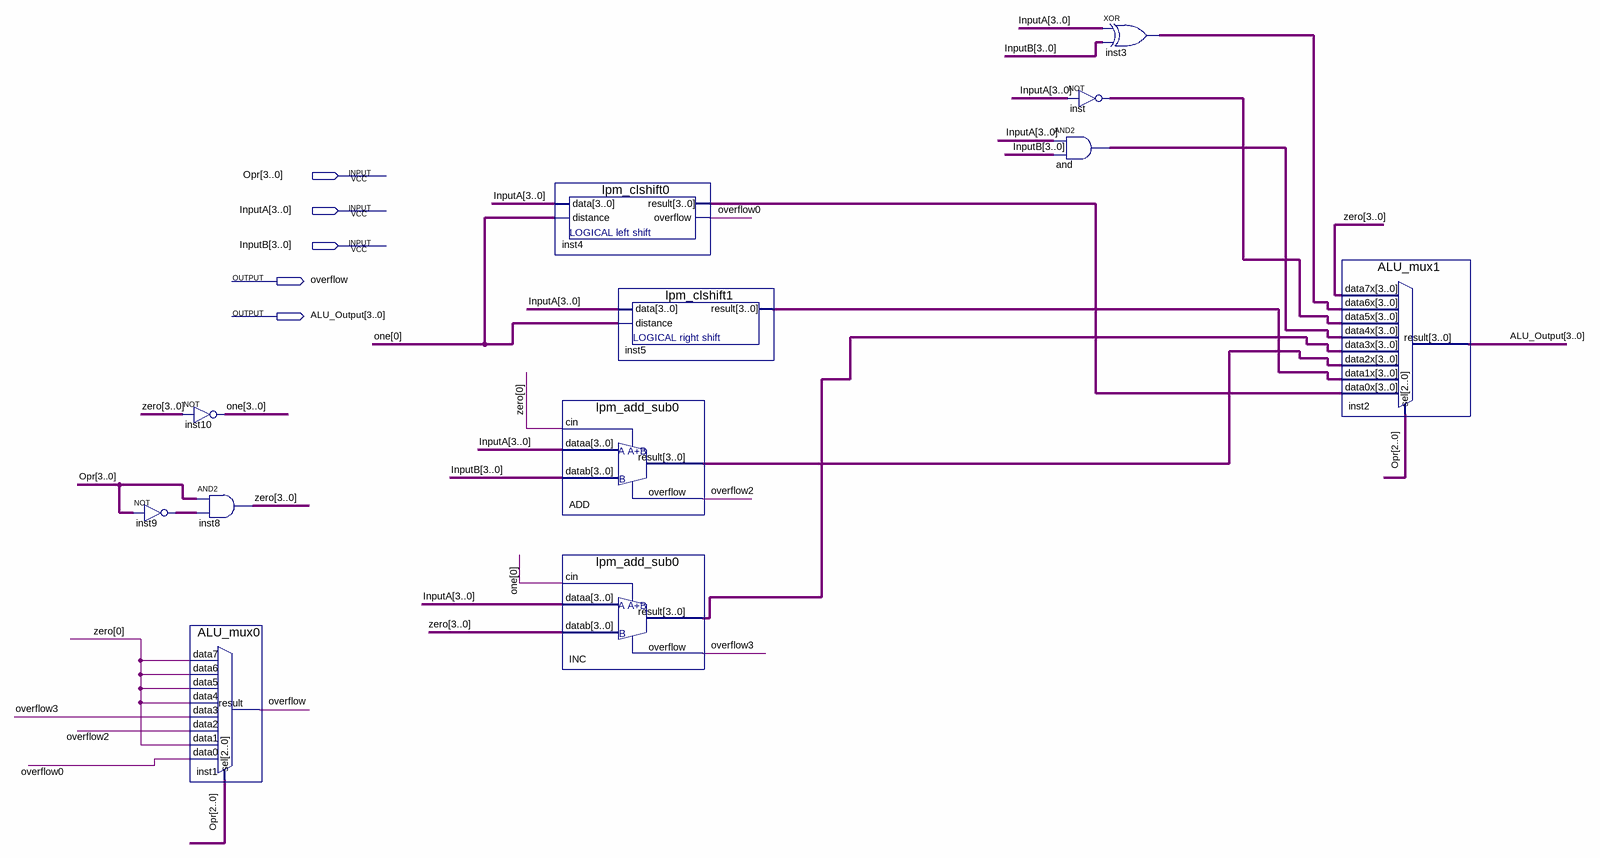
[diagram p0: schematic sheet]
// Quartus schematic 2019510083_Ata_Can_Yaymaci_ALU.bdf as structural Verilog: 12 symbols, 5 pins
module \2019510083_Ata_Can_Yaymaci_ALU  (
  input  [3:0] Opr,
  input  [3:0] InputA,
  input  [3:0] InputB,
  output overflow,
  output [3:0] ALU_Output
);

  wire overflow0, overflow2, overflow3;
  wire [3:0] ADD_result, and_out, INC_result, inst3_out, inst4_result, inst5_result, inst9_out, inst_out,
       one, zero;

  assign inst9_out = ~Opr;  // NOT inst9, 4 bits wide
  assign one = ~zero;  // NOT inst10, 4 bits wide
  assign zero = Opr & inst9_out;  // AND2 inst8, 4 bits wide
  ALU_mux0 inst1 (
    .data7(zero[0]), .data6(zero[0]), .data5(zero[0]), .data4(zero[0]), .data3(overflow3), .data2(overflow2),
    .data1(zero[0]), .data0(overflow0), .sel(Opr[2:0]), .result(overflow));
  lpm_clshift0 inst4 (.data(InputA), .distance(one[0]), .result(inst4_result), .overflow(overflow0));
  lpm_add_sub0 ADD (.cin(zero[0]), .dataa(InputA), .datab(InputB), .result(ADD_result), .overflow(overflow2));
  lpm_add_sub0 INC (.cin(one[0]), .dataa(InputA), .datab(zero), .result(INC_result), .overflow(overflow3));
  lpm_clshift1 inst5 (.data(InputA), .distance(one[0]), .result(inst5_result));
  assign and_out = InputA & InputB;  // AND2 and, 4 bits wide
  assign inst3_out = InputA ^ InputB;  // XOR inst3, 4 bits wide
  assign inst_out = ~InputA;  // NOT inst, 4 bits wide
  ALU_mux1 inst2 (
    .data7x(zero), .data6x(inst3_out), .data5x(inst_out), .data4x(and_out), .data3x(INC_result),
    .data2x(ADD_result), .data1x(inst5_result), .data0x(inst4_result), .sel(Opr[2:0]), .result(ALU_Output));
endmodule
